# Altium schematic sheet Reset.SchDoc
size A
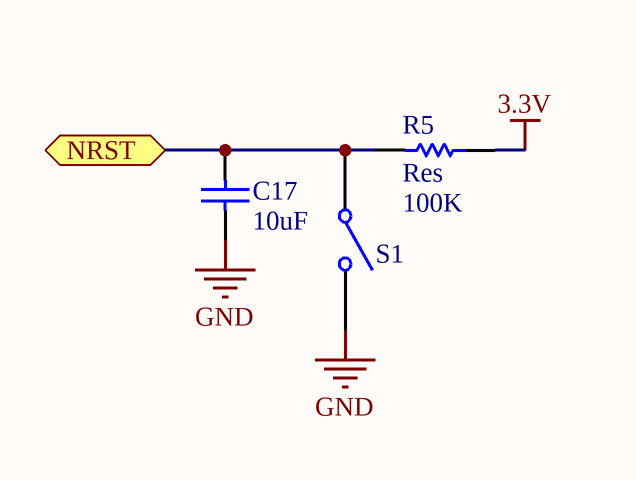
[diagram p0: Reset.SchDoc]

## Parts
C17  value 10uF  [2012[0805]]  (hidden comment: Cap_UP)
R5  Res  value 100K  [2012[0805]]
S1  SW-SPST  [SW-SMD]  (value not drawn)

## Ports
NRST

## Nets
3.3V: R5.1
GND: C17.1 S1.2(NO)
NRST: C17.2 R5.2 S1.1(COMMON) ; port NRST

## Library data of the parts
C17 = Cap_UP: Capacitor; Published: 8-Jun-2000; LatestRevisionDate: 17-Jul-2002; LatestRevisionNote: Re-released for DXP Platform.; PackageReference: RAD-0.3; Publisher: Altium Limited
R5 = Res: Semiconductor Resistor; Published: 8-Jun-2000; LatestRevisionDate: 17-Jul-2002; LatestRevisionNote: Re-released for DXP Platform.; PackageReference: AXIAL-0.5; Publisher: Altium Limited
S1 = SW-SPST: Single-Pole, Single-Throw Switch; Published: 24-Mar-1999; Revision: July-2002: Re-released for DXP Platform.; Publisher: Altium Limited